# EAGLE schematic 08E-005 (EAGLE 6.3)
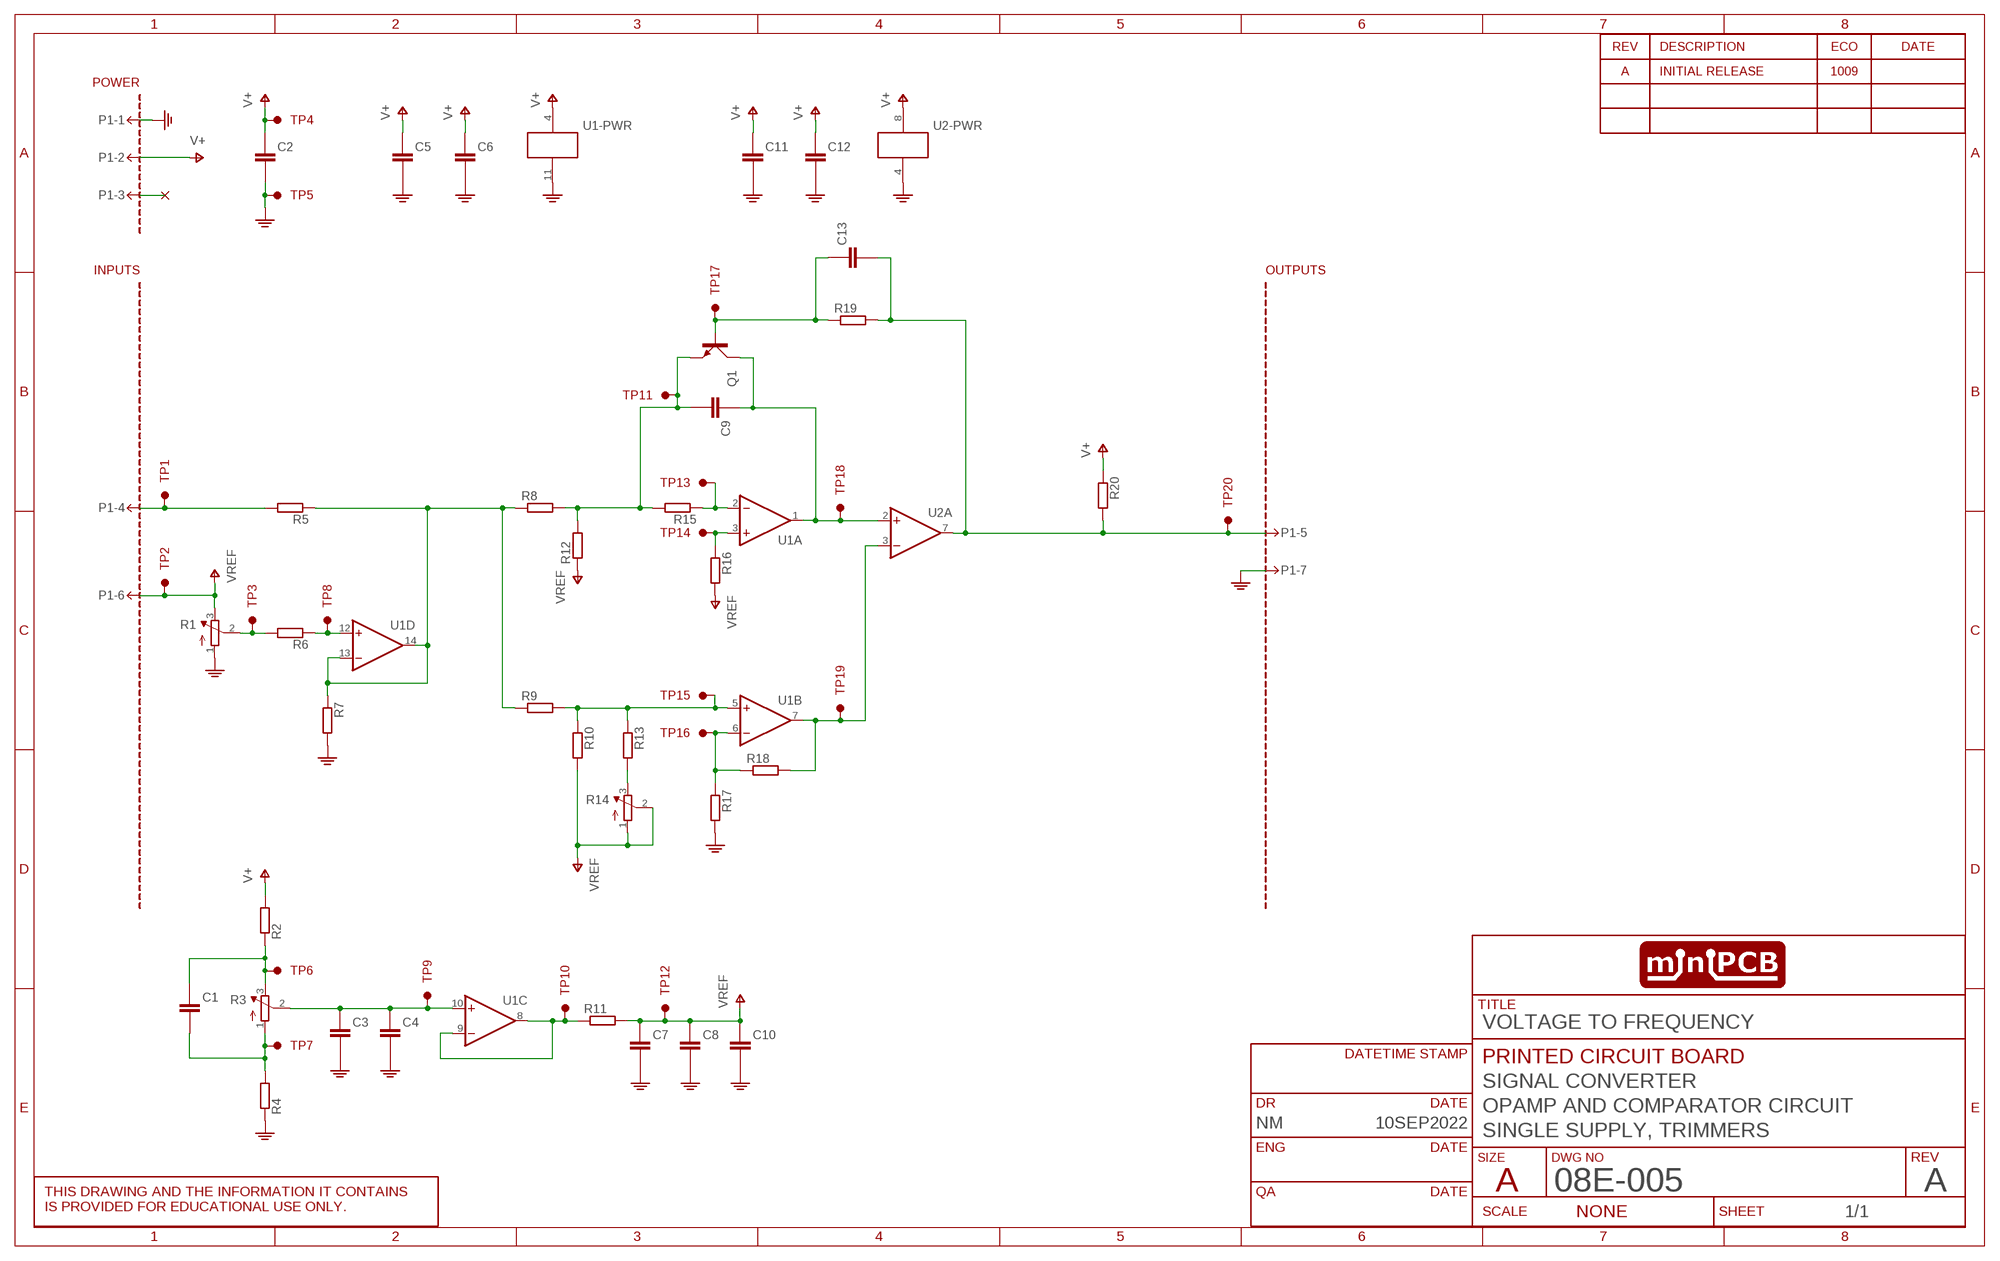
[diagram p0: schematic, sheet 1]
SHEET1 (SCHEMATIC): CIRCUIT_CATEGORY: SIGNAL CONVERTER; CIRCUIT_NAME: OPAMP AND COMPARATOR CIRCUIT; CIRCUIT_VARIANT: SINGLE SUPPLY, TRIMMERS; DR: NM; DR_DATE: 10SEP2022; REVA: A; REVA_ECO: 1009; REVISION: A; TITLE: VOLTAGE TO FREQUENCY

## Parts
C1  CAPACITORTHD  [C050-024X044]
C2  CAPACITOR_10  [C5MM]
C3  CAPACITORTHD  [C050-024X044]
C4  CAPACITORTHD  [C050-024X044]
C5  CAPACITORTHD  [C050-024X044]
C6  CAPACITORTHD  [C050-024X044]
C7  CAPACITORTHD  [C050-024X044]
C8  CAPACITORTHD  [C050-024X044]
C9  CAPACITORTHD  [C050-024X044]
C10  CAPACITOR_10  [C5MM]
C11  CAPACITORTHD  [C050-024X044]
C12  CAPACITORTHD  [C050-024X044]
C13  CAPACITORTHD  [C050-024X044]
P1-  MINIPCB_7P50X100  [MINIPCB_7P_50X100]
Q1  BJT_NPNEBC  [TO92-EBC-OVAL]
R1  TRIMPOT3386  [TRIM-3386]
R2  RESISTOR10MM  [0207/10]
R3  TRIMPOT0.100THD  [TRIM_0100]
R4  RESISTOR10MM  [0207/10]
R5  RESISTOR10MM  [0207/10]
R6  RESISTOR10MM  [0207/10]
R7  RESISTOR10MM  [0207/10]
R8  RESISTOR10MM  [0207/10]
R9  RESISTOR10MM  [0207/10]
R10  RESISTOR10MM  [0207/10]
R11  RESISTOR10MM  [0207/10]
R12  RESISTOR10MM  [0207/10]
R13  RESISTOR10MM  [0207/10]
R14  TRIMPOT0.100THD  [TRIM_0100]
R15  RESISTOR10MM  [0207/10]
R16  RESISTOR10MM  [0207/10]
R17  RESISTOR10MM  [0207/10]
R18  RESISTOR10MM  [0207/10]
R19  RESISTOR10MM  [0207/10]
R20  RESISTOR10MM  [0207/10]
TP1  TESTPOINTKE5000-SMTEXT  [PINS_1_TESTPOINT_KE5000_NOTEXT]
TP2  TESTPOINTKE5000-SMTEXT  [PINS_1_TESTPOINT_KE5000_NOTEXT]
TP3  TESTPOINTKE5000-SMTEXT  [PINS_1_TESTPOINT_KE5000_NOTEXT]
TP4  TESTPOINTKE5000-SMTEXT  [PINS_1_TESTPOINT_KE5000_NOTEXT]
TP5  TESTPOINTKE5000-SMTEXT  [PINS_1_TESTPOINT_KE5000_NOTEXT]
TP6  TESTPOINTKE5000-SMTEXT  [PINS_1_TESTPOINT_KE5000_NOTEXT]
TP7  TESTPOINTKE5000-SMTEXT  [PINS_1_TESTPOINT_KE5000_NOTEXT]
TP8  TESTPOINTKE5000-SMTEXT  [PINS_1_TESTPOINT_KE5000_NOTEXT]
TP9  TESTPOINTKE5000-SMTEXT  [PINS_1_TESTPOINT_KE5000_NOTEXT]
TP10  TESTPOINTKE5000-SMTEXT  [PINS_1_TESTPOINT_KE5000_NOTEXT]
TP11  TESTPOINTKE5000-SMTEXT  [PINS_1_TESTPOINT_KE5000_NOTEXT]
TP12  TESTPOINTKE5000-SMTEXT  [PINS_1_TESTPOINT_KE5000_NOTEXT]
TP13  TESTPOINTKE5000-SMTEXT  [PINS_1_TESTPOINT_KE5000_NOTEXT]
TP14  TESTPOINTKE5000-SMTEXT  [PINS_1_TESTPOINT_KE5000_NOTEXT]
TP15  TESTPOINTKE5000-SMTEXT  [PINS_1_TESTPOINT_KE5000_NOTEXT]
TP16  TESTPOINTKE5000-SMTEXT  [PINS_1_TESTPOINT_KE5000_NOTEXT]
TP17  TESTPOINTKE5000-SMTEXT  [PINS_1_TESTPOINT_KE5000_NOTEXT]
TP18  TESTPOINTKE5000-SMTEXT  [PINS_1_TESTPOINT_KE5000_NOTEXT]
TP19  TESTPOINTKE5000-SMTEXT  [PINS_1_TESTPOINT_KE5000_NOTEXT]
TP20  TESTPOINTKE5000-SMTEXT  [PINS_1_TESTPOINT_KE5000_NOTEXT]
U1  OPAMP_QUADTHD  [DIL14]
U2  COMPARATOR_SINGLE_WITHBALANCETHD  [DIL08]

## Nets
BIAS: C3.1(+) C4.1(+) R3.2(S) TP9.1 U1.10(C:+IN)
GND: C2.- C3.2(-) C4.2(-) C5.2(-) C6.2(-) C7.2(-) C8.2(-) C10.- C11.2(-) C12.2(-) P1-.1 P1-.7 R1.1(A) R4.1 R7.2 R17.2 TP5.1 U1.11(-PWR:V-) U2.4(-PWR:V-)
N$1: P1-.4 R5.2 TP1.1
N$2: R16.1 TP14.1 U1.3(A:+IN)
N$3: R15.1 TP13.1 U1.2(A:-IN)
N$4: R5.1 R7.1 R8.1 R9.1 U1.13(D:-IN) U1.14(D:OUT)
N$5: C9.2(-) Q1.E R8.2 R12.2 R15.2 TP11.1
N$6: C13.2(-) P1-.5 R19.2 R20.2 TP20.1 U2.7(A:OUT)
N$7: C9.1(+) Q1.C TP18.1 U1.1(A:OUT) U2.2(A:+IN)
N$8: C13.1(+) Q1.B R19.1 TP17.1
N$9: R11.1 TP10.1 U1.8(C:OUT) U1.9(C:-IN)
N$10: R17.1 R18.1 TP16.1 U1.6(B:-IN)
N$11: R18.2 TP19.1 U1.7(B:OUT) U2.3(A:-IN)
N$12: R6.1 TP8.1 U1.12(D:+IN)
N$13: R1.2(S) R6.2 TP3.1
N$15: R9.2 R10.1 R13.1 TP15.1 U1.5(B:+IN)
N$19: R13.2 R14.3(E)
NC: P1-.3
POT.1: C1.2(-) R3.1(A) R4.2 TP7.1
POT.3: C1.1(+) R2.1 R3.3(E) TP6.1
V+: C2.+ C5.1(+) C6.1(+) C11.1(+) C12.1(+) P1-.2 R2.2 R20.1 TP4.1 U1.4(-PWR:V+) U2.8(-PWR:V+)
VREF: C7.1(+) C8.1(+) C10.+ P1-.6 R1.3(E) R10.2 R11.2 R12.1 R14.1(A) R14.2(S) R16.2 TP2.1 TP12.1
Unconnected: U2.1 U2.5 U2.6

## Library data of the parts
C1-C13 = minipcb:CAPACITOR
P1- = minipcb:MINIPCB_7P; PART_NUMBER: X08E-005-A
Q1 = minipcb:BJT_NPN: TRANSISTOR
R1 R3 R14 = minipcb:TRIMPOT: SMT trimmer potentiometer part number TC33X http://www.ladyada.net/library/eagle
R2 R4-R13 R15-R20 = minipcb:RESISTOR
TP1-TP20 = minipcb:TESTPOINT
U1 = minipcb:OPAMP_QUAD: OP AMP
U2 = minipcb:COMPARATOR_SINGLE_WITHBALANCE